# Altium project LED_Chaser_8051.PrjPcb
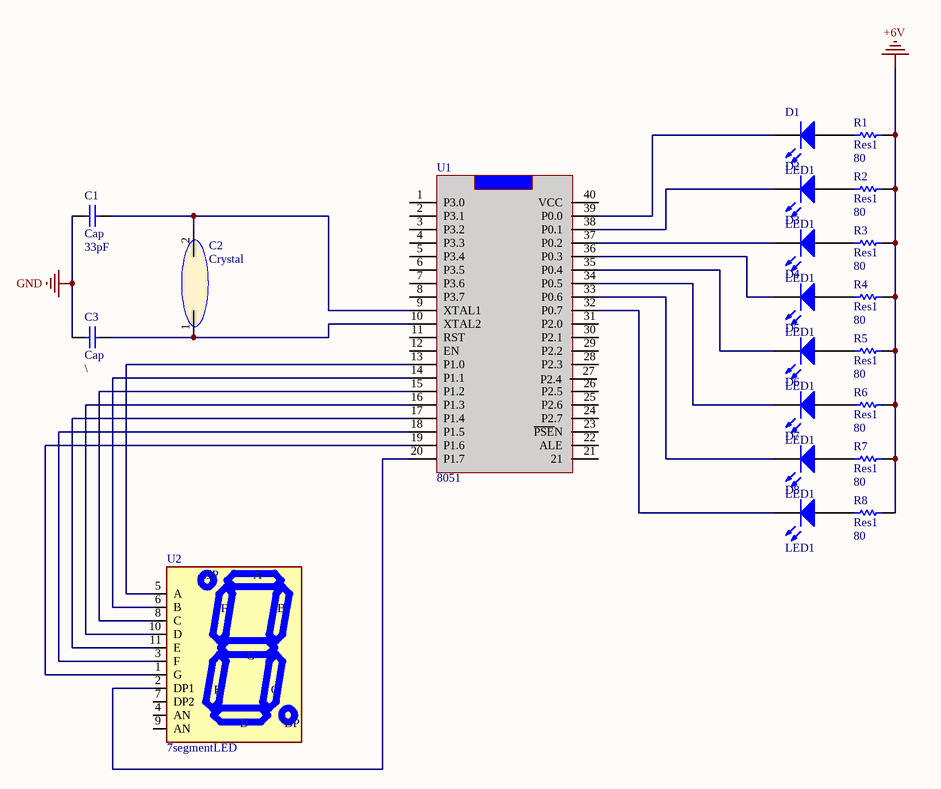
[diagram p0: Sch.SchDoc]
1 sheet, 21 parts. Net scope: global (net labels, ports and power ports of the same name join across sheets).
Board file: PCB.PcbDoc

## Sheet Sch.SchDoc
size A4

### Parts
C1  Cap  value 33pF  [Cap]
C2  Crystal  [Crystal]
C3  Cap  value \  [Cap]
D1  LED1  [LED]
D2  LED1  [LED]
D3  LED1  [LED]
D4  LED1  [LED]
D5  LED1  [LED]
D6  LED1  [LED]
D7  LED1  [LED]
D8  LED1  [LED]
R1  Res1  value 80  [Res]
R2  Res1  value 80  [Res]
R3  Res1  value 80  [Res]
R4  Res1  value 80  [Res]
R5  Res1  value 80  [Res]
R6  Res1  value 80  [Res]
R7  Res1  value 80  [Res]
R8  Res1  value 80  [Res]
U1  8051  [8051]
U2  7segmentLED  [Display]

### Nets
+6V: R1.2 R2.2 R3.2 R4.2 R5.2 R6.2 R7.2 R8.2
GND: C1.1 C3.1
NetC1_2: C1.2 C2.2 U1.9(XTAL1)
NetC2_1: C2.1 C3.2 U1.10(XTAL2)
NetD1_1: D1.1(A) R1.1
NetD1_2: D1.2(K) U1.39(P0.0)
NetD2_1: D2.1(A) R2.1
NetD2_2: D2.2(K) U1.38(P0.1)
NetD3_1: D3.1(A) R3.1
NetD3_2: D3.2(K) U1.37(P0.2)
NetD4_1: D4.1(A) R4.1
NetD4_2: D4.2(K) U1.36(P0.3)
NetD5_1: D5.1(A) R5.1
NetD5_2: D5.2(K) U1.35(P0.4)
NetD6_1: D6.1(A) R6.1
NetD6_2: D6.2(K) U1.34(P0.5)
NetD7_1: D7.1(A) R7.1
NetD7_2: D7.2(K) U1.33(P0.6)
NetD8_1: D8.1(A) R8.1
NetD8_2: D8.2(K) U1.32(P0.7)
NetU1_13: U1.13(P1.0) U2.5(A)
NetU1_14: U1.14(P1.1) U2.6(B)
NetU1_15: U1.15(P1.2) U2.8(C)
NetU1_16: U1.16(P1.3) U2.10(D)
NetU1_17: U1.17(P1.4) U2.11(E)
NetU1_18: U1.18(P1.5) U2.3(F)
NetU1_19: U1.19(P1.6) U2.1(G)
NetU1_20: U1.20(P1.7) U2.2(DP1)

Not connected (* = marked no-connect by the designer): U1 1(P3.0) 2(P3.1) 3(P3.2) 4(P3.3) 5(P3.4) 6(P3.5) 7(P3.6) 8(P3.7) 11(RST) 12(EN) 21 22(ALE) 23(~{PSE}N) 24(P2.7) 25(P2.6) 26(P2.5) 27(P2.4) 28(P2.3) 29(P2.2) 30(P2.1) 31(P2.0) 40(VCC); U2 4(AN) 7(DP2) 9(AN)

### Notes on the sheet
- (in symbol 7segmentLED) DP

### Library data of the parts
C1 C3 = Cap: Capacitor; Published: 8-Jun-2000; LatestRevisionDate: 17-Jul-2002; LatestRevisionNote: Re-released for DXP Platform.; PackageReference: RAD-0.3; Publisher: Altium Limited; PackageDescription: Radial Cap, Thru-Hole; 2 Leads; 0.3 in Pin Spacing
D1-D8 = LED1: Typical RED GaAs LED; Published: 8-Jun-2000; LatestRevisionDate: 08-Jul-2005; LatestRevisionNote: Mech Layer 1 removed.; PackageReference: LED-1; Publisher: Altium Limited; PackageDescription: LED; 2 Leads
R1-R8 = Res1: Resistor; Published: 8-Jun-2000; LatestRevisionDate: 17-Jul-2002; LatestRevisionNote: Re-released for DXP Platform.; PackageReference: AXIAL-0.3; Publisher: Altium Limited; PackageDescription: Axial Device, Thru-Hole; 2 Leads; 0.3 in Pin Spacing